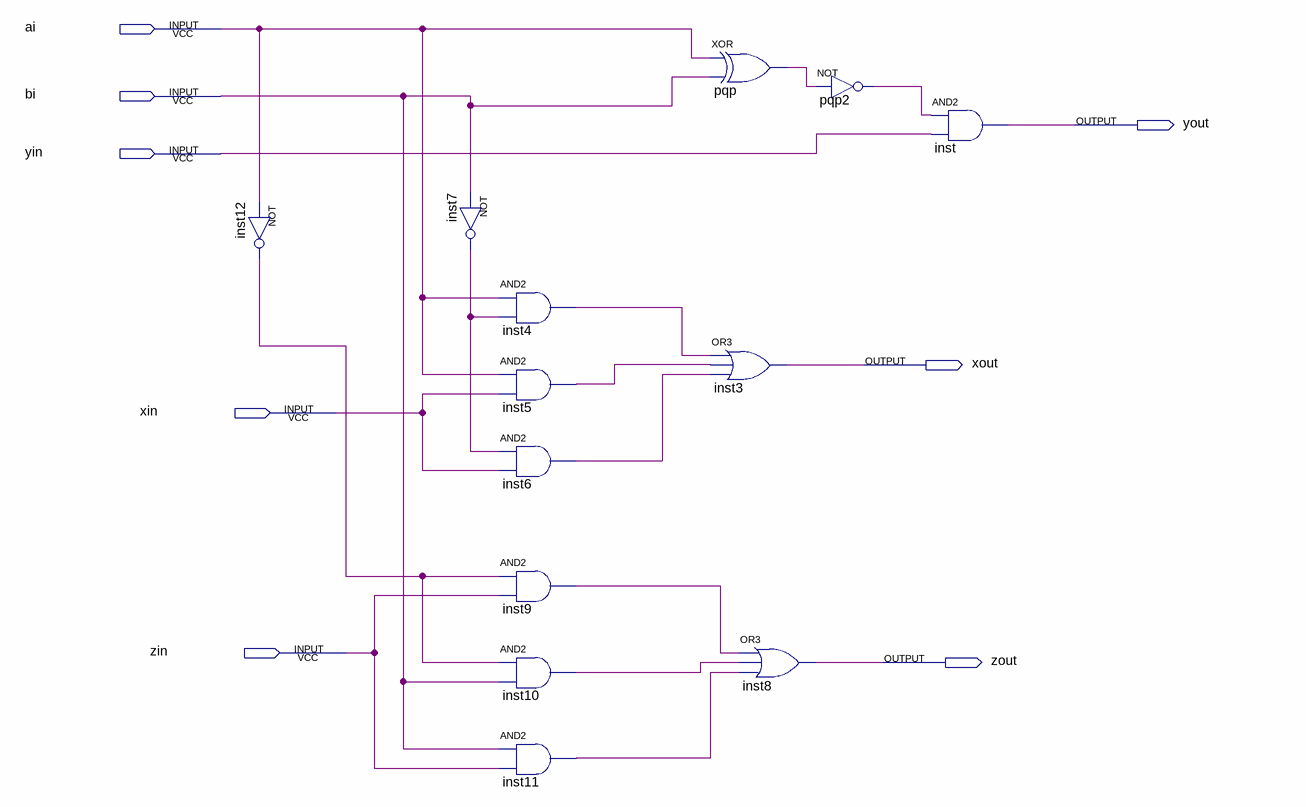
[diagram p0: schematic sheet]
// Quartus schematic Cmp8bit.bdf as structural Verilog: 13 symbols, 8 pins
module Cmp8bit (
  input  ai,
  input  bi,
  input  yin,
  input  xin,
  input  zin,
  output yout,
  output xout,
  output zout
);

  wire inst4_out, inst5_out, inst6_out, inst7_out, inst9_out, inst10_out, inst11_out, inst12_out, pqp2_out,
       pqp_out;

  not inst12 (inst12_out, ai);
  not inst7 (inst7_out, bi);
  and inst4 (inst4_out, ai, inst7_out);
  and inst5 (inst5_out, ai, xin);
  and inst6 (inst6_out, inst7_out, xin);
  and inst9 (inst9_out, inst12_out, zin);
  and inst10 (inst10_out, inst12_out, bi);
  and inst11 (inst11_out, bi, zin);
  xor pqp (pqp_out, ai, bi);
  or inst3 (xout, inst4_out, inst5_out, inst6_out);
  or inst8 (zout, inst9_out, inst10_out, inst11_out);
  not pqp2 (pqp2_out, pqp_out);
  and inst (yout, pqp2_out, yin);
endmodule
